# Altium schematic sheet AT short bus ( 7 x 4.2 inches).schdoc: AT short bus ( 7 x 4.2 inches)
size A; Organization: Organization; Address1: Address1; Address2: Address2; Address3: Address3; Address4: Address4; DocumentNumber: 1; Revision: 0; SheetNumber: 2; SheetTotal: 2
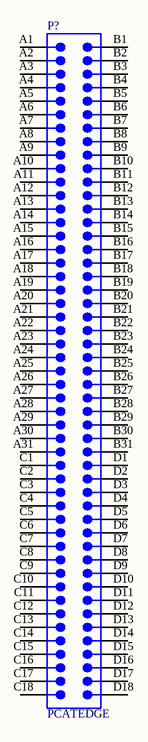
[diagram p0: AT short bus ( 7 x 4.2 inches).schdoc]

## Parts
P?  PCATEDGE  [PCATEDGE]

## Nets

Not connected (* = marked no-connect by the designer): P? A1 A2 A3 A4 A5 A6 A7 A8 A9 A10 A11 A12 A13 A14 A15 A16 A17 A18 A19 A20 A21 A22 A23 A24 A25 A26 A27 A28 A29 A30 A31 B1 B2 B3 B4 B5 B6 B7 B8 B9 B10 B11 B12 B13 B14 B15 B16 B17 B18 B19 B20 B21 B22 B23 B24 B25 B26 B27 B28 B29 B30 B31 C1 C2 C3 C4 C5 C6 C7 C8 C9 C10 C11 C12 C13 C14 C15 C16 C17 C18 D1 D2 D3 D4 D5 D6 D7 D8 D9 D10 D11 D12 D13 D14 D15 D16 D17 D18

## Library data of the parts
P? = PCATEDGE: Card, 98-Position; Text Field6: Alternate Layout Available; Text Field7: Published 14-Feb-2002